# Altium schematic sheet SIM.SchDoc
size A3; SheetNumber: 1; SheetTotal: 5
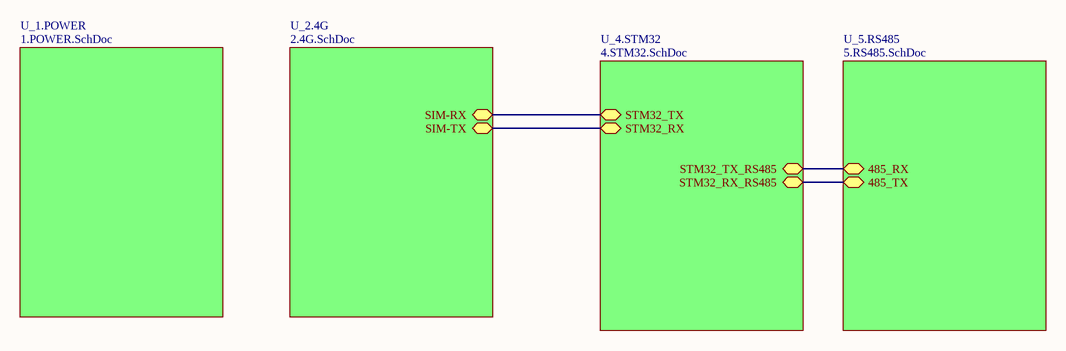
[diagram p0: SIM.SchDoc]

## Sub-sheets
U_1.POWER = 1.POWER.SchDoc: no entries
U_2.4G = 2.4G.SchDoc: SIM-TX (bidir), SIM-RX (bidir)
U_4.STM32 = 4.STM32.SchDoc: STM32_TX (bidir), STM32_RX (bidir), STM32_TX_RS485 (bidir), STM32_RX_RS485 (bidir)
U_5.RS485 = 5.RS485.SchDoc: 485_TX (bidir), 485_RX (bidir)

## Nets
(unnamed): sheet U_2.4G/SIM-TX, sheet U_4.STM32/STM32_RX
(unnamed): sheet U_2.4G/SIM-RX, sheet U_4.STM32/STM32_TX
(unnamed): sheet U_4.STM32/STM32_TX_RS485, sheet U_5.RS485/485_RX
(unnamed): sheet U_4.STM32/STM32_RX_RS485, sheet U_5.RS485/485_TX